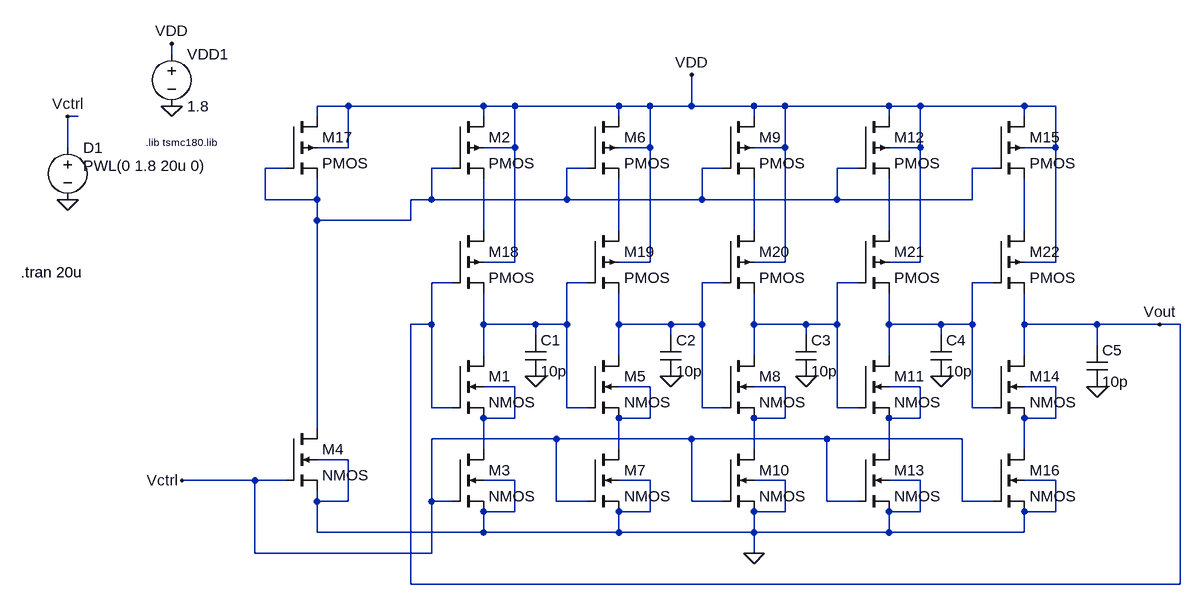
[diagram p0: schematic test_vco.asc]
test_vco.asc, the LTspice schematic file:
Version 4
SHEET 1 880 680
WIRE -784 -512 -784 -528
WIRE -512 -432 -560 -432
WIRE -304 -432 -512 -432
WIRE -256 -432 -304 -432
WIRE -96 -432 -256 -432
WIRE -48 -432 -96 -432
WIRE 16 -432 16 -480
WIRE 16 -432 -48 -432
WIRE 112 -432 16 -432
WIRE 160 -432 112 -432
WIRE 320 -432 160 -432
WIRE 368 -432 320 -432
WIRE 528 -432 368 -432
WIRE 576 -432 528 -432
WIRE -928 -416 -944 -416
WIRE -560 -416 -560 -432
WIRE -304 -416 -304 -432
WIRE -96 -416 -96 -432
WIRE 112 -416 112 -432
WIRE 320 -416 320 -432
WIRE 528 -416 528 -432
WIRE -944 -368 -944 -416
WIRE -512 -368 -512 -432
WIRE -512 -368 -560 -368
WIRE -256 -368 -256 -432
WIRE -256 -368 -304 -368
WIRE -48 -368 -48 -432
WIRE -48 -368 -96 -368
WIRE 160 -368 160 -432
WIRE 160 -368 112 -368
WIRE 368 -368 368 -432
WIRE 368 -368 320 -368
WIRE 576 -368 576 -432
WIRE 576 -368 528 -368
WIRE -608 -336 -640 -336
WIRE -352 -336 -384 -336
WIRE -144 -336 -176 -336
WIRE 64 -336 32 -336
WIRE 272 -336 240 -336
WIRE 480 -336 448 -336
WIRE -640 -288 -640 -336
WIRE -560 -288 -560 -320
WIRE -560 -288 -640 -288
WIRE -384 -288 -384 -336
WIRE -384 -288 -416 -288
WIRE -176 -288 -176 -336
WIRE -176 -288 -384 -288
WIRE 32 -288 32 -336
WIRE 32 -288 -176 -288
WIRE 240 -288 240 -336
WIRE 240 -288 32 -288
WIRE 448 -288 448 -336
WIRE 448 -288 240 -288
WIRE -560 -256 -560 -288
WIRE -416 -256 -416 -288
WIRE -416 -256 -560 -256
WIRE -304 -240 -304 -320
WIRE -96 -240 -96 -320
WIRE 112 -240 112 -320
WIRE 320 -240 320 -320
WIRE 528 -240 528 -320
WIRE -256 -192 -256 -368
WIRE -256 -192 -304 -192
WIRE -48 -192 -48 -368
WIRE -48 -192 -96 -192
WIRE 160 -192 160 -368
WIRE 160 -192 112 -192
WIRE 368 -192 368 -368
WIRE 368 -192 320 -192
WIRE 576 -192 576 -368
WIRE 576 -192 528 -192
WIRE -352 -160 -384 -160
WIRE -144 -160 -176 -160
WIRE 64 -160 32 -160
WIRE 272 -160 240 -160
WIRE 480 -160 448 -160
WIRE -384 -96 -384 -160
WIRE -384 -96 -416 -96
WIRE -304 -96 -304 -144
WIRE -224 -96 -304 -96
WIRE -176 -96 -176 -160
WIRE -176 -96 -224 -96
WIRE -96 -96 -96 -144
WIRE -16 -96 -96 -96
WIRE 32 -96 32 -160
WIRE 32 -96 -16 -96
WIRE 112 -96 112 -144
WIRE 192 -96 112 -96
WIRE 240 -96 240 -160
WIRE 240 -96 192 -96
WIRE 320 -96 320 -144
WIRE 400 -96 320 -96
WIRE 448 -96 448 -160
WIRE 448 -96 400 -96
WIRE 528 -96 528 -144
WIRE 640 -96 528 -96
WIRE 736 -96 640 -96
WIRE 768 -96 736 -96
WIRE -224 -80 -224 -96
WIRE -16 -80 -16 -96
WIRE 192 -80 192 -96
WIRE 400 -80 400 -96
WIRE 640 -64 640 -96
WIRE -304 -48 -304 -96
WIRE -96 -48 -96 -96
WIRE 112 -48 112 -96
WIRE 320 -48 320 -96
WIRE 528 -48 528 -96
WIRE -256 0 -304 0
WIRE -48 0 -96 0
WIRE 160 0 112 0
WIRE 368 0 320 0
WIRE 576 0 528 0
WIRE -384 32 -384 -96
WIRE -352 32 -384 32
WIRE -176 32 -176 -96
WIRE -144 32 -176 32
WIRE 32 32 32 -96
WIRE 64 32 32 32
WIRE 240 32 240 -96
WIRE 272 32 240 32
WIRE 448 32 448 -96
WIRE 480 32 448 32
WIRE -256 48 -256 0
WIRE -256 48 -304 48
WIRE -48 48 -48 0
WIRE -48 48 -96 48
WIRE 160 48 160 0
WIRE 160 48 112 48
WIRE 368 48 368 0
WIRE 368 48 320 48
WIRE 576 48 576 0
WIRE 576 48 528 48
WIRE -560 64 -560 -256
WIRE -192 80 -384 80
WIRE 16 80 -192 80
WIRE 224 80 16 80
WIRE 432 80 224 80
WIRE -304 96 -304 48
WIRE -96 96 -96 48
WIRE 112 96 112 48
WIRE 320 96 320 48
WIRE 528 96 528 48
WIRE -512 112 -560 112
WIRE -656 144 -768 144
WIRE -608 144 -656 144
WIRE -256 144 -304 144
WIRE -48 144 -96 144
WIRE 160 144 112 144
WIRE 368 144 320 144
WIRE 576 144 528 144
WIRE -560 176 -560 160
WIRE -512 176 -512 112
WIRE -512 176 -560 176
WIRE -384 176 -384 80
WIRE -352 176 -384 176
WIRE -192 176 -192 80
WIRE -144 176 -192 176
WIRE 16 176 16 80
WIRE 64 176 16 176
WIRE 224 176 224 80
WIRE 272 176 224 176
WIRE 432 176 432 80
WIRE 480 176 432 176
WIRE -256 192 -256 144
WIRE -256 192 -304 192
WIRE -48 192 -48 144
WIRE -48 192 -96 192
WIRE 160 192 160 144
WIRE 160 192 112 192
WIRE 368 192 368 144
WIRE 368 192 320 192
WIRE 576 192 576 144
WIRE 576 192 528 192
WIRE -560 224 -560 176
WIRE -304 224 -304 192
WIRE -304 224 -560 224
WIRE -96 224 -96 192
WIRE -96 224 -304 224
WIRE 112 224 112 192
WIRE 112 224 -96 224
WIRE 320 224 320 192
WIRE 320 224 112 224
WIRE 528 224 528 192
WIRE 528 224 320 224
WIRE -656 256 -656 144
WIRE -384 256 -384 176
WIRE -384 256 -656 256
WIRE 112 256 112 224
WIRE -416 304 -416 -96
WIRE 768 304 768 -96
WIRE 768 304 -416 304
FLAG 16 -480 VDD
FLAG 112 256 0
FLAG 736 -96 Vout
FLAG -768 144 Vctrl
FLAG -224 -16 0
FLAG -16 -16 0
FLAG 192 -16 0
FLAG 400 -16 0
FLAG 640 0 0
FLAG -944 -288 0
FLAG -784 -432 0
FLAG -784 -528 VDD
FLAG -944 -416 Vctrl
SYMBOL nmos4 -352 -48 R0
SYMATTR InstName M1
SYMATTR Value2 l=180n w=2u
SYMBOL pmos4 -352 -416 R0
SYMATTR InstName M2
SYMATTR Value2 l=180n w=4u
SYMBOL nmos4 -352 96 R0
SYMATTR InstName M3
SYMATTR Value2 l=180n w=2u
SYMBOL nmos4 -608 64 R0
SYMATTR InstName M4
SYMATTR Value2 l=180n w=2u
SYMBOL nmos4 -144 -48 R0
SYMATTR InstName M5
SYMATTR Value2 l=180n w=2u
SYMBOL pmos4 -144 -416 R0
SYMATTR InstName M6
SYMATTR Value2 l=180n w=4u
SYMBOL nmos4 -144 96 R0
SYMATTR InstName M7
SYMATTR Value2 l=180n w=2u
SYMBOL nmos4 64 -48 R0
SYMATTR InstName M8
SYMATTR Value2 l=180n w=2u
SYMBOL pmos4 64 -416 R0
SYMATTR InstName M9
SYMATTR Value2 l=180n w=4u
SYMBOL nmos4 64 96 R0
SYMATTR InstName M10
SYMATTR Value2 l=180n w=2u
SYMBOL nmos4 272 -48 R0
SYMATTR InstName M11
SYMATTR Value2 l=180n w=2u
SYMBOL pmos4 272 -416 R0
SYMATTR InstName M12
SYMATTR Value2 l=180n w=4u
SYMBOL nmos4 272 96 R0
SYMATTR InstName M13
SYMATTR Value2 l=180n w=2u
SYMBOL nmos4 480 -48 R0
SYMATTR InstName M14
SYMATTR Value2 l=180n w=2u
SYMBOL pmos4 480 -416 R0
SYMATTR InstName M15
SYMATTR Value2 l=180n w=4u
SYMBOL nmos4 480 96 R0
SYMATTR InstName M16
SYMATTR Value2 l=180n w=2u
SYMBOL pmos4 -608 -416 R0
SYMATTR InstName M17
SYMATTR Value2 l=180n w=4u
SYMBOL pmos4 -352 -240 R0
SYMATTR InstName M18
SYMATTR Value2 l=180n w=4u
SYMBOL pmos4 -144 -240 R0
SYMATTR InstName M19
SYMATTR Value2 l=180n w=4u
SYMBOL pmos4 64 -240 R0
SYMATTR InstName M20
SYMATTR Value2 l=180n w=4u
SYMBOL pmos4 272 -240 R0
SYMATTR InstName M21
SYMATTR Value2 l=180n w=4u
SYMBOL pmos4 480 -240 R0
SYMATTR InstName M22
SYMATTR Value2 l=180n w=4u
SYMBOL cap -240 -80 R0
SYMATTR InstName C1
SYMATTR Value 10p
SYMBOL cap -32 -80 R0
SYMATTR InstName C2
SYMATTR Value 10p
SYMBOL cap 176 -80 R0
SYMATTR InstName C3
SYMATTR Value 10p
SYMBOL cap 384 -80 R0
SYMATTR InstName C4
SYMATTR Value 10p
SYMBOL cap 624 -64 R0
SYMATTR InstName C5
SYMATTR Value 10p
SYMBOL voltage -944 -384 R0
WINDOW 123 0 0 Left 0
WINDOW 39 24 124 Left 2
WINDOW 3 24 44 Left 2
SYMATTR Value PWL(0 1.8 20u 0)
SYMATTR InstName D1
SYMBOL voltage -784 -528 R0
WINDOW 123 0 0 Left 0
WINDOW 39 24 124 Left 2
SYMATTR InstName VDD1
SYMATTR Value 1.8
TEXT -1016 -176 Left 2 !.tran 20u
TEXT -824 -376 Left 1 !.lib tsmc180.lib

The netlist it stands for:
* test_vco.asc
M1 N007 Vout N011 N011 NMOS l=180n w=2u
M2 VDD N001 N002 VDD PMOS l=180n w=4u
M3 N011 Vctrl 0 0 NMOS l=180n w=2u
M4 N001 Vctrl 0 0 NMOS l=180n w=2u
M5 N008 N007 N012 N012 NMOS l=180n w=2u
M6 VDD N001 N003 VDD PMOS l=180n w=4u
M7 N012 Vctrl 0 0 NMOS l=180n w=2u
M8 N009 N008 N013 N013 NMOS l=180n w=2u
M9 VDD N001 N004 VDD PMOS l=180n w=4u
M10 N013 Vctrl 0 0 NMOS l=180n w=2u
M11 N010 N009 N014 N014 NMOS l=180n w=2u
M12 VDD N001 N005 VDD PMOS l=180n w=4u
M13 N014 Vctrl 0 0 NMOS l=180n w=2u
M14 Vout N010 N015 N015 NMOS l=180n w=2u
M15 VDD N001 N006 VDD PMOS l=180n w=4u
M16 N015 Vctrl 0 0 NMOS l=180n w=2u
M17 VDD N001 N001 VDD PMOS l=180n w=4u
M18 N002 Vout N007 VDD PMOS l=180n w=4u
M19 N003 N007 N008 VDD PMOS l=180n w=4u
M20 N004 N008 N009 VDD PMOS l=180n w=4u
M21 N005 N009 N010 VDD PMOS l=180n w=4u
M22 N006 N010 Vout VDD PMOS l=180n w=4u
C1 N007 0 10p
C2 N008 0 10p
C3 N009 0 10p
C4 N010 0 10p
C5 Vout 0 10p
V§D1 Vctrl 0 PWL(0 1.8 20u 0)
VDD1 VDD 0 1.8
.model NMOS NMOS
.model PMOS PMOS
.lib standard.mos
.tran 20u
.lib tsmc180.lib
.backanno
.end